# EAGLE design phantom_power (EAGLE 9.6.2)
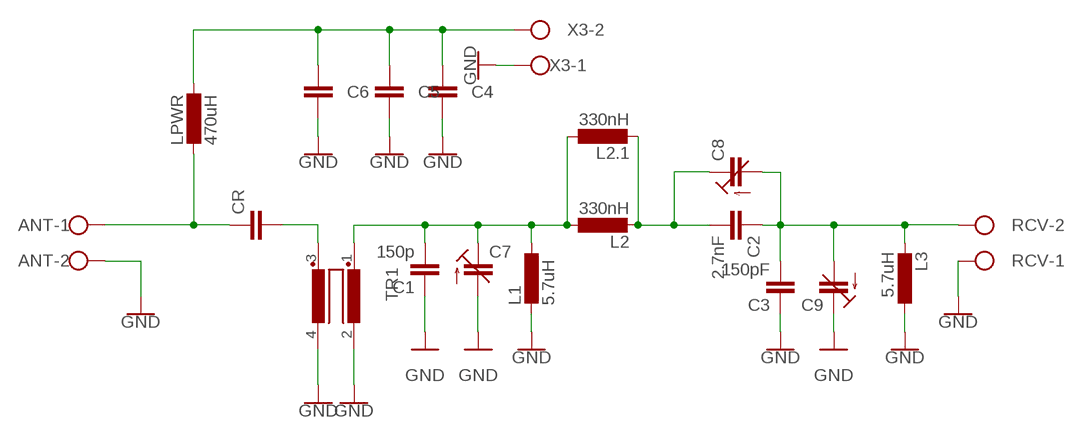
[diagram p0: schematic, sheet 1]

## Parts
ANT  W237-102  [W237-102]
C1  150p  C-EUC1206K  [C1206K]
C2  2.7nF  C-EUC1206K  [C1206K]
C3  150pF  C-EUC1206K  [C1206K]
C4  C-EUC1206K  [C1206K]
C5  C-EUC1206K  [C1206K]
C6  C-EUC1206K  [C1206K]
C7  C-TRIMM3050.504  [CTRIM3050.504]
C8  C-TRIMM3050.504  [CTRIM3050.504]
C9  C-TRIMM3050.504  [CTRIM3050.504]
CR  C-EUC1206K  [C1206K]
L1  5.7uH  L-EU0204/7  [0204/7]
L2  330nH  L-EUL1812  [L1812]
L2.1  330nH  L-EU0204/7  [0204/7]
L3  5.7uH  L-EU0204/7  [0204/7]
LPWR  470uH  L-EU0204/7  [0204/7]
RCV  W237-102  [W237-102]
TR1  R1405UB1/2  [B1/2]
X3  W237-102  [W237-102]

## Nets
GND: ANT.2 C1.1 C3.1 C4.2 C5.2 C6.2 C7.2(A) C9.1(E) L1.2 L3.1 RCV.1 TR1.2 TR1.4 X3.1
N$1: ANT.1 CR.1 LPWR.2
N$2: C4.1 C5.1 C6.1 LPWR.1 X3.2
N$3: C2.1 C3.2 C8.2(A) C9.2(A) L3.2 RCV.2
N$6: C1.2 C7.1(E) L1.1 L2.1 L2.1.1 TR1.1
N$7: C2.2 C8.1(E) L2.1.2 L2.2
N$8: CR.2 TR1.3

## Library data of the parts
ANT RCV X3 = con-wago-500:W237-102: WAGO SCREW CLAMP; MPN: 237-102; OC_FARNELL: unknown; OC_NEWARK: 70K9898
C1-C6 CR = rcl:C-EU: CAPACITOR, European symbol; SPICEPREFIX: C
C7-C9 = rcl:C-TRIMM: Trimm capacitor; SPICEPREFIX: C
L1 L2 L2.1 L3 LPWR = rcl:L-EU: INDUCTOR, European symbol; SPICEPREFIX: L
TR1 = inductor-nkl:R1405U: Gleichtakt-Entstördrossel (über typ. 5MHz) common mode choke (above typ.5MHz); OC_FARNELL: unknown; OC_NEWARK: unknown

## Board
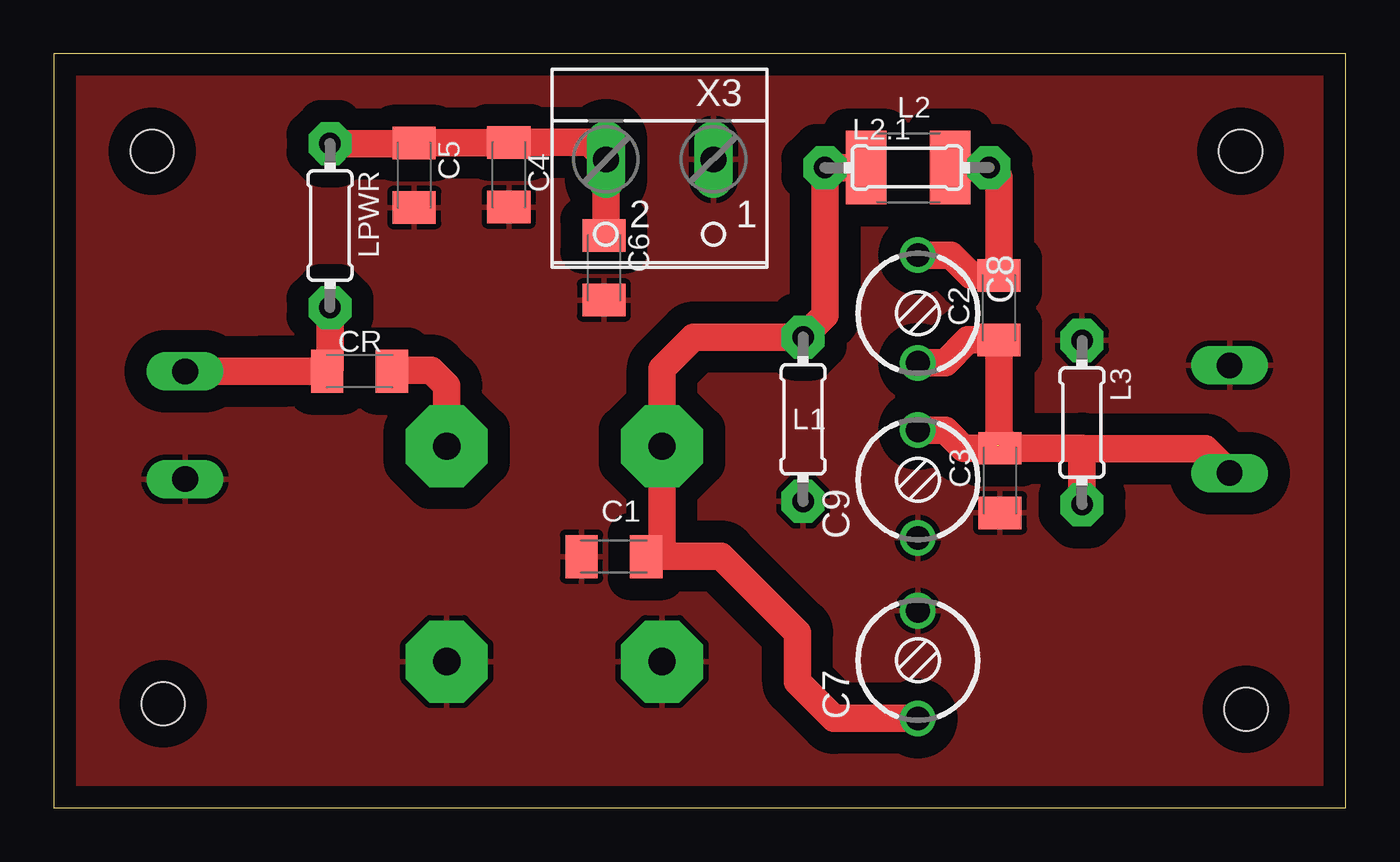
[diagram p1: board, top side]
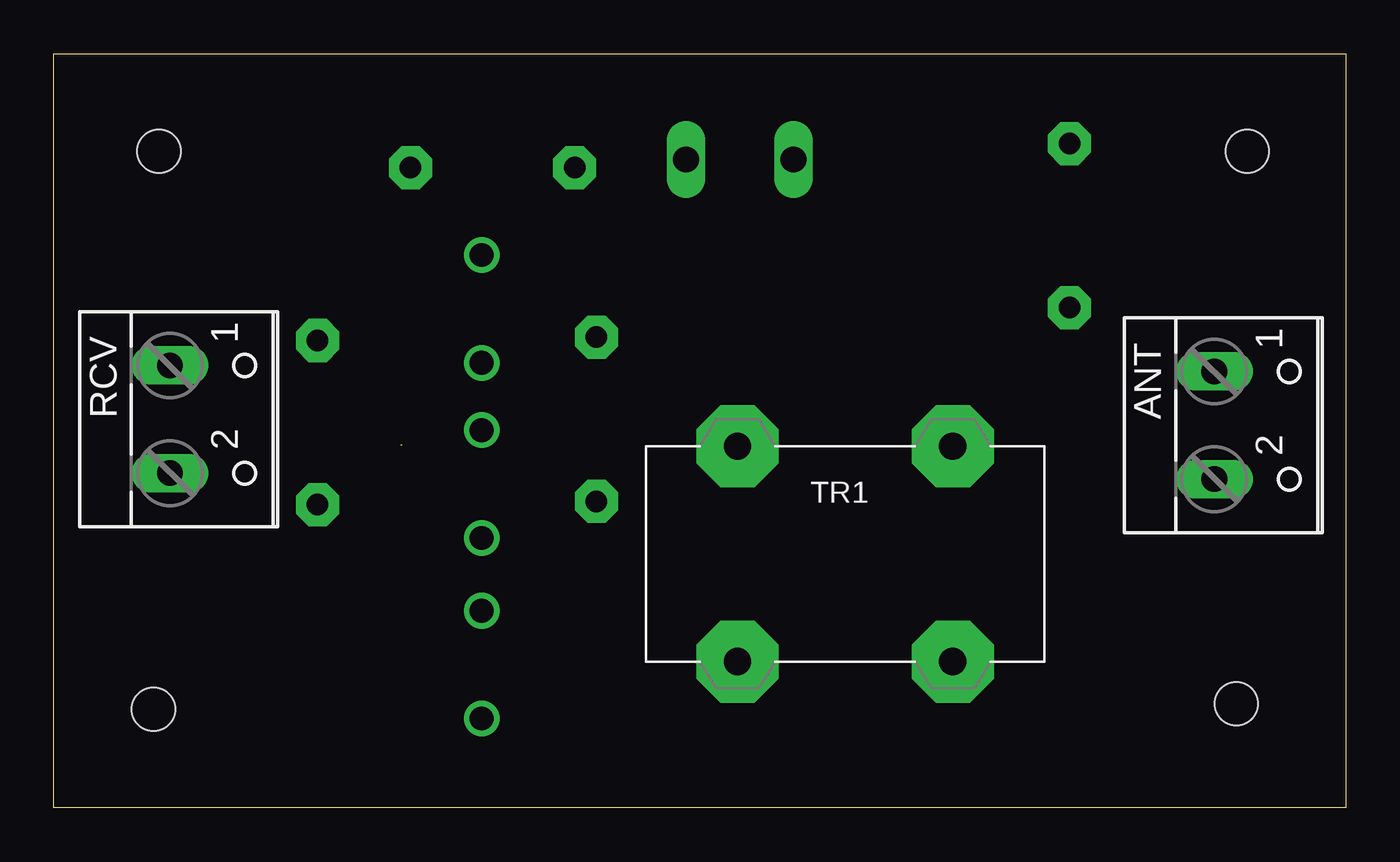
[diagram p2: board, bottom side, seen from below]

Size 60 x 35 mm. Coordinates in mm from the lower left corner, seen from the top.
Outline: 0,35 0,0 60,0 60,35 0,35
Copper layers (1*16): Top 0.035mm / dielectric 1.5mm / Bottom 0.035mm
Design rules "default": minimum track width 6mil, minimum drill 0.35mm, track to track 6mil, track to pad 6mil, pad to pad 6mil, via to via 6mil, smd to smd 6mil, copper to edge 40mil, drill to drill 6mil, minimum pad ring 10mil, minimum via ring 8mil, stop-mask expansion 4mil, vias tented up to drill 0mil, thermal gap 10mil
Holes 2 mm at 5.08,4.83 55.37,4.57 55.12,30.48 4.57,30.48

### Footprints (pad centres in the part's own frame; a part is rotated, then mirrored left to right if it is on the bottom)
W237-102 = drill 1.194 long: 1 -2.5,-1.27; 2 2.5,-1.27
C1206K = smd 1.5 x 2: 1 -1.5,0; 2 1.5,0
CTRIM3050.504 = drill 1.1: 1 -2.5,0; 2 2.5,0
0204/7 = drill 1 pad 2 octagon: 1 -3.81,0; 2 3.81,0
L1812 = smd 1.9 x 3.4: 1 -1.95,0; 2 1.95,0
B1/2 = drill 1.27 pad 3.81 octagon: 1 -5,5; 2 -5,-5; 3 5,5; 4 5,-5

### Placement (x,y rotation side)
ANT  4.83,17.75 270 bottom
C1  26.01,11.66 0 top
C2  43.89,23.22 90 top
C3  43.94,15.19 90 top
C4  21.13,29.39 270 top
C5  16.74,29.36 270 top
C6  25.55,25.07 270 top
C7  40.13,6.64 90 top
C8  40.13,23.15 270 top
C9  40.13,15.03 90 top
CR  14.2,20.27 0 top
L1  34.8,18.03 270 top
L2  39.68,29.72 0 top
L2.1  39.62,29.72 0 top
L3  47.75,17.88 270 top
LPWR  12.83,27.03 270 top
RCV  53.34,18.03 270 bottom
TR1  23.25,11.78 0 bottom
X3  28.14,28.83 180 top

### Tracks (layer width: path | path; a pad name or v marks a point on that pad's centre or on a via)
GND
  pour Top (isolate 1.016): -1.27,35.81 -1.27,-1.52 61.47,-1.52 61.47,35.81
N$1
  Top 1.27: ANT.1 9.65,20.25 | 9.65,20.25 10.67,20.25 | 9.65,20.25 9.67,20.27 CR.1 12.83,20.4 LPWR.2
N$2
  Top 1.27: 16.69,30.91 C5.1 | C5.1 21.11,30.86 C4.1 24.85,30.89 X3.2 25.64,26.66 C6.1 | LPWR.1 16.71,30.84 C5.1
N$3  (1 unrouted)
  Top 1.27: 43.89,16.83 C2.1 42.46,21.72 41.4,20.65 C8.2 | C3.2 43.81,16.82 | 44.2,16.94 C3.2 | C3.2 47.75,16.69 47.75,16.66 | 47.75,16.66 53.48,16.66 RCV.2 | L3.2 47.75,16.66 | C3.2 42.24,16.69 41.4,17.53 C9.2
N$6
  Top 1.27: C1.2 27.49,11.68 28.25,11.68 | 28.25,11.68 TR1.1 28.25,20.37 29.72,21.84 L1.1 35.81,22.86 L2.1.1 L2.1 | C7.1 36.24,4.14 34.54,5.84 34.54,8.13 30.99,11.68 28.25,11.68
N$7
  Top 1.27: L2.2 L2.1.2 43.89,29.26 C2.2 42.59,24.72 41.66,25.65 C8.1
N$8
  Top 1.27: TR1.3 18.25,19.6 17.53,20.32 15.75,20.32 CR.2